# Altium schematic sheet P10_HDMI Framer.SchDoc
size 386 x 246 mm
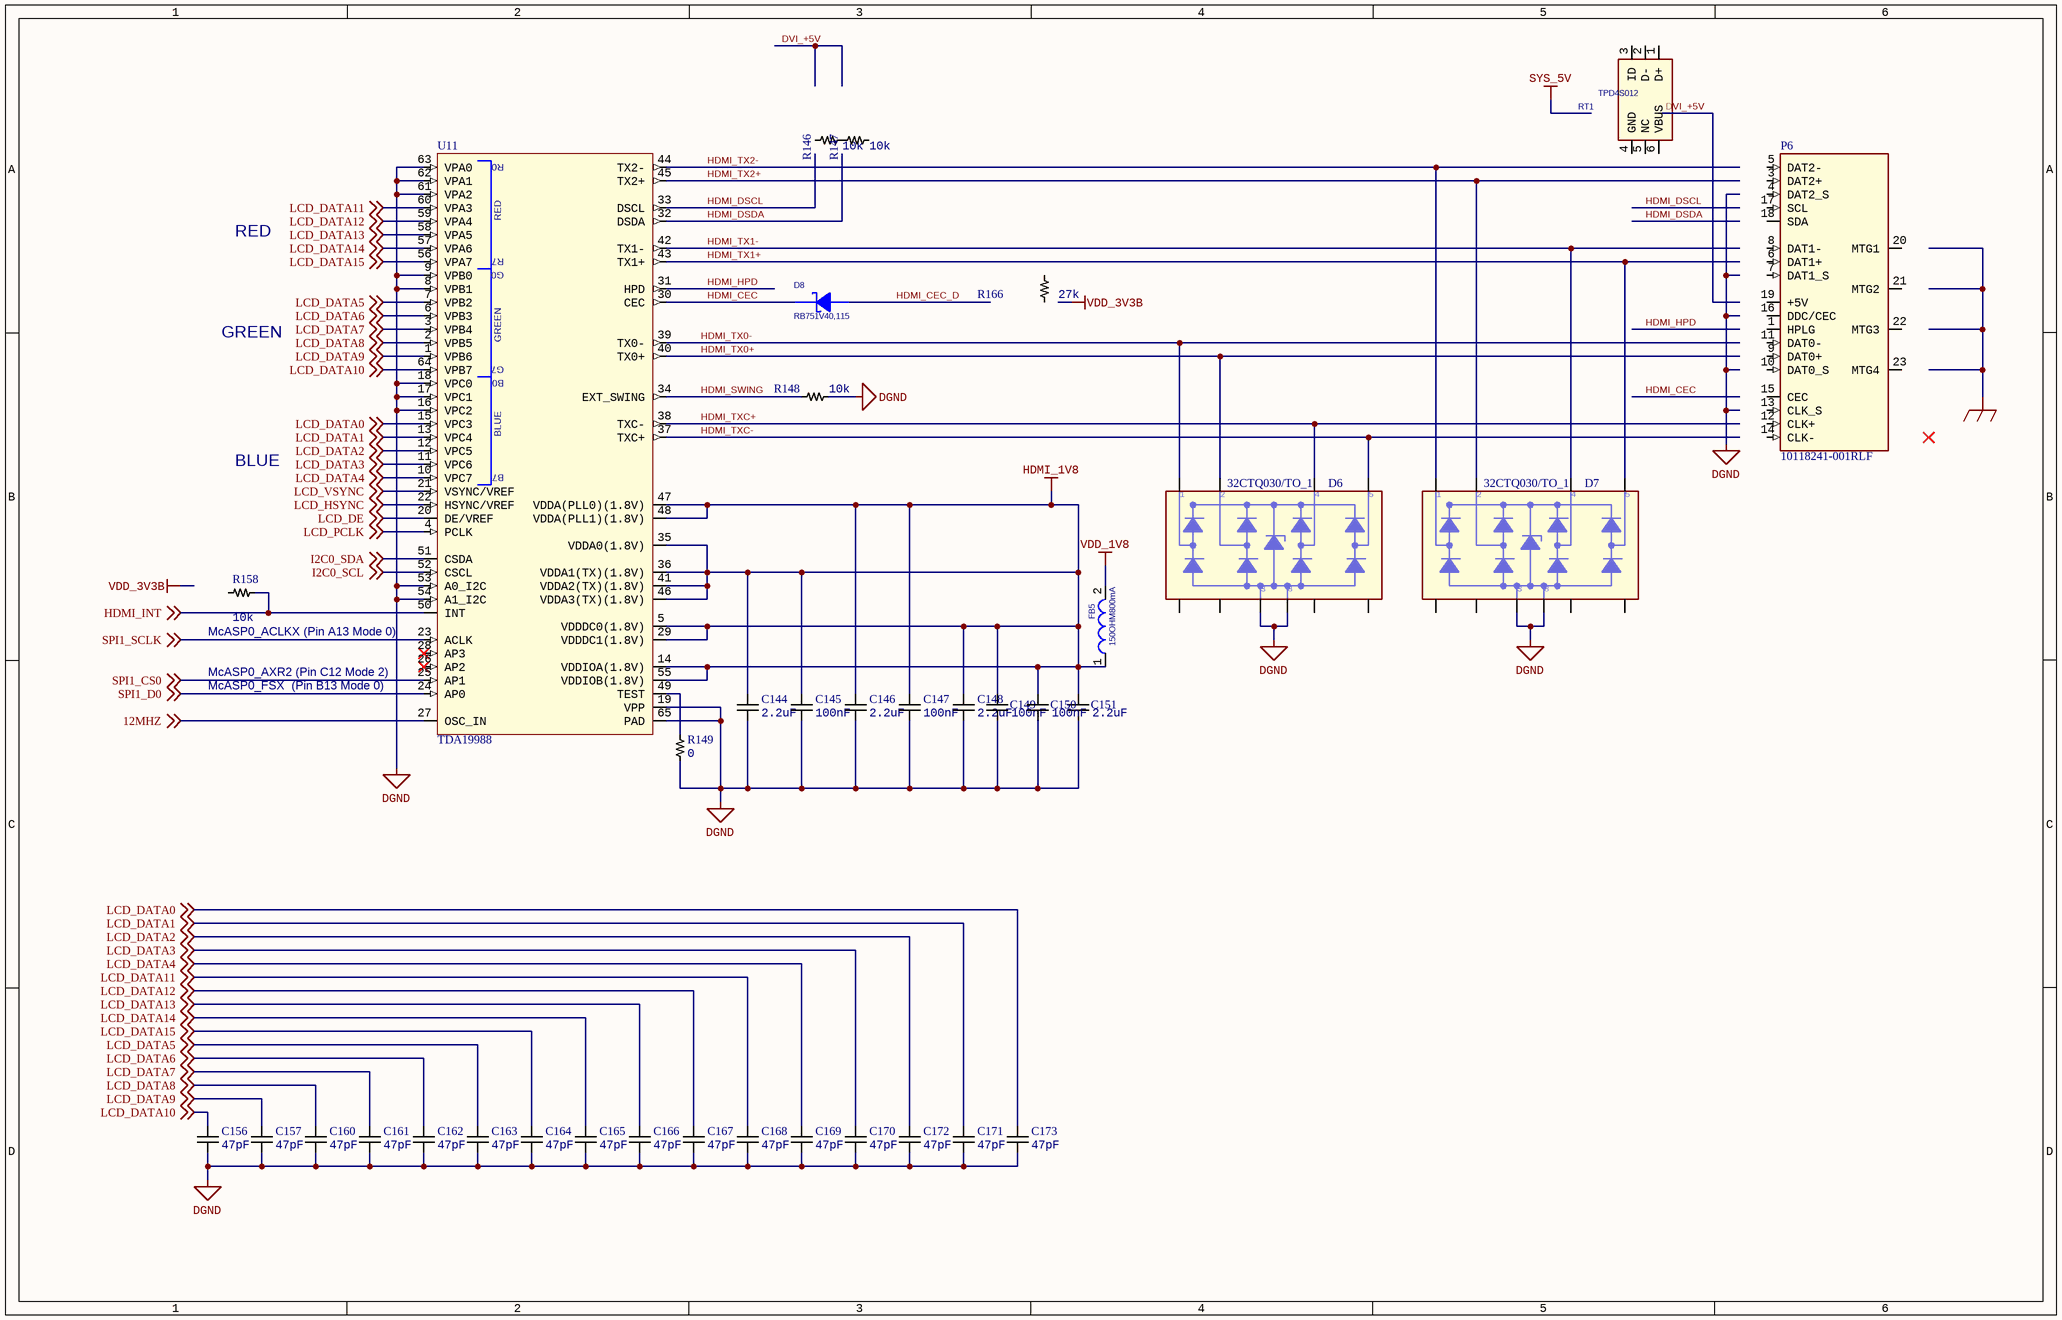
[diagram p0: P10_HDMI Framer.SchDoc]

## Parts
C144  Capacitance: 2.2uF  [CAP0402]  (hidden comment: C1005X5R0J225K050BC)
C145  Capacitance: 100nF  [CAP0402]  (hidden comment: C0402C104K4RACTU)
C146  Capacitance: 2.2uF  [CAP0402]  (hidden comment: C1005X5R0J225K050BC)
C147  Capacitance: 100nF  [CAP0402]  (hidden comment: C0402C104K4RACTU)
C148  Capacitance: 2.2uF  [CAP0402]  (hidden comment: C1005X5R0J225K050BC)
C149  Capacitance: 100nF  [CAP0402]  (hidden comment: C0402C104K4RACTU)
C150  Capacitance: 100nF  [CAP0402]  (hidden comment: C0402C104K4RACTU)
C151  Capacitance: 2.2uF  [CAP0402]  (hidden comment: C1005X5R0J225K050BC)
C156  Capacitance: 47pF  [CAP0402]  (hidden comment: CC0402JRNPO9BN470)
C157  Capacitance: 47pF  [CAP0402]  (hidden comment: CC0402JRNPO9BN470)
C160  Capacitance: 47pF  [CAP0402]  (hidden comment: CC0402JRNPO9BN470)
C161  Capacitance: 47pF  [CAP0402]  (hidden comment: CC0402JRNPO9BN470)
C162  Capacitance: 47pF  [CAP0402]  (hidden comment: CC0402JRNPO9BN470)
C163  Capacitance: 47pF  [CAP0402]  (hidden comment: CC0402JRNPO9BN470)
C164  Capacitance: 47pF  [CAP0402]  (hidden comment: CC0402JRNPO9BN470)
C165  Capacitance: 47pF  [CAP0402]  (hidden comment: CC0402JRNPO9BN470)
C166  Capacitance: 47pF  [CAP0402]  (hidden comment: CC0402JRNPO9BN470)
C167  Capacitance: 47pF  [CAP0402]  (hidden comment: CC0402JRNPO9BN470)
C168  Capacitance: 47pF  [CAP0402]  (hidden comment: CC0402JRNPO9BN470)
C169  Capacitance: 47pF  [CAP0402]  (hidden comment: CC0402JRNPO9BN470)
C170  Capacitance: 47pF  [CAP0402]  (hidden comment: CC0402JRNPO9BN470)
C171  Capacitance: 47pF  [CAP0402]  (hidden comment: CC0402JRNPO9BN470)
C172  Capacitance: 47pF  [CAP0402]  (hidden comment: CC0402JRNPO9BN470)
C173  Capacitance: 47pF  [CAP0402]  (hidden comment: CC0402JRNPO9BN470)
D6  32CTQ030/TO_1  [TSSOP10]
D7  32CTQ030/TO_1  [TSSOP10]
D8  RB751V40,115  [SOD323]
FB5  150OHM800mA  [FB0805]
P6  10118241-001RLF  [CONN19_HDMI]
R146  Resistance: 10k  [RES0402]  (hidden comment: RC0402FR-0710KL)
R147  Resistance: 10k  [RES0402]  (hidden comment: RC0402FR-0710KL)
R148  Resistance: 10k  [RES0402]  (hidden comment: RC0402FR-0710KL)
R149  Resistance: 0  [RES0402]  (hidden comment: RC0402JR-070RL)
R158  Resistance: 10k  [RES0402]  (hidden comment: RC0402FR-0710KL)
R166  Resistance: 27k  [RES0402]  (hidden comment: RC0402FR-0727KL)
RT1  TPD4S012  [U_6_DRY]
U11  TDA19988  [HVQFN-64]

## Nets
DGND: C144.2 C145.2 C146.2 C147.2 C148.2 C149.2 C150.2 C151.2 C156.2 C157.2 C160.2 C161.2 C162.2 C163.2 C164.2 C165.2 C166.2 C167.2 C168.2 C169.2 C170.2 C171.2 C172.2 C173.2 D6.3 D6.8 D7.3 D7.8 R148.2 R149.2 U11.8(VPB1) U11.9(VPB0) U11.16(VPC2) U11.17(VPC1) U11.18(VPC0) U11.19(VPP) U11.53(A0_I2C) U11.54(A1_I2C) U11.61(VPA2) U11.62(VPA1) U11.63(VPA0) U11.65(PAD)
HDMI_1V8: C144.1 C145.1 C146.1 C147.1 C148.1 C149.1 C150.1 C151.1 FB5.1 U11.5(VDDDC0(1.8V)) U11.14(VDDIOA(1.8V)) U11.29(VDDDC1(1.8V)) U11.35(VDDA0(1.8V)) U11.36(VDDA1(TX)(1.8V)) U11.41(VDDA2(TX)(1.8V)) U11.46(VDDA3(TX)(1.8V)) U11.47(VDDA(PLL0)(1.8V)) U11.48(VDDA(PLL1)(1.8V)) U11.55(VDDIOB(1.8V))
VDD_1V8: FB5.2
12MHZ: U11.27(OSC_IN) ; off-sheet 12MHZ
HDMI_CEC: D8.1(C) U11.30(CEC)
HDMI_CEC_D: D8.2(A)
HDMI_DSCL: U11.33(DSCL)
HDMI_DSDA: U11.32(DSDA)
HDMI_HPD: U11.31(HPD)
HDMI_INT: R158.2 U11.50(INT) ; off-sheet HDMI_INT
HDMI_SWING: R148.1 U11.34(EXT_SWING)
HDMI_TX0+: D6.2 U11.40(TX0+)
HDMI_TX0-: D6.1 U11.39(TX0-)
HDMI_TX1+: D7.5 U11.43(TX1+)
HDMI_TX1-: D7.4 U11.42(TX1-)
HDMI_TX2+: D7.2 U11.45(TX2+)
HDMI_TX2-: D7.1 U11.44(TX2-)
HDMI_TXC+: D6.4 U11.38(TXC-)
HDMI_TXC-: D6.5 U11.37(TXC+)
I2C0_SCL: U11.52(CSCL) ; off-sheet I2C0_SCL
I2C0_SDA: U11.51(CSDA) ; off-sheet I2C0_SDA
LCD_DATA0: C173.1 U11.15(VPC3) ; off-sheet LCD_DATA0
LCD_DATA1: C171.1 U11.13(VPC4) ; off-sheet LCD_DATA1
LCD_DATA2: C172.1 U11.12(VPC5) ; off-sheet LCD_DATA2
LCD_DATA3: C170.1 U11.11(VPC6) ; off-sheet LCD_DATA3
LCD_DATA4: C169.1 U11.10(VPC7) ; off-sheet LCD_DATA4
LCD_DATA5: C163.1 U11.7(VPB2) ; off-sheet LCD_DATA5
LCD_DATA6: C162.1 U11.6(VPB3) ; off-sheet LCD_DATA6
LCD_DATA7: C161.1 U11.3(VPB4) ; off-sheet LCD_DATA7
LCD_DATA8: C160.1 U11.2(VPB5) ; off-sheet LCD_DATA8
LCD_DATA9: C157.1 U11.1(VPB6) ; off-sheet LCD_DATA9
LCD_DATA10: C156.1 U11.64(VPB7) ; off-sheet LCD_DATA10
LCD_DATA11: C168.1 U11.60(VPA3) ; off-sheet LCD_DATA11
LCD_DATA12: C167.1 U11.59(VPA4) ; off-sheet LCD_DATA12
LCD_DATA13: C166.1 U11.58(VPA5) ; off-sheet LCD_DATA13
LCD_DATA14: C165.1 U11.57(VPA6) ; off-sheet LCD_DATA14
LCD_DATA15: C164.1 U11.56(VPA7) ; off-sheet LCD_DATA15
LCD_DE: U11.20(DE/VREF) ; off-sheet LCD_DE
LCD_HSYNC: U11.22(HSYNC/VREF) ; off-sheet LCD_HSYNC
LCD_PCLK: U11.4(PCLK) ; off-sheet LCD_PCLK
LCD_VSYNC: U11.21(VSYNC/VREF) ; off-sheet LCD_VSYNC
SPI1_CS0: U11.25(AP1) ; off-sheet SPI1_CS0
SPI1_D0: U11.24(AP0) ; off-sheet SPI1_D0
SPI1_SCLK: U11.23(ACLK) ; off-sheet SPI1_SCLK
NetR146_1: R146.1 R147.2
NetR149_1: R149.1 U11.49(TEST)

Not connected (* = marked no-connect by the designer): D6 6 7 9 10; D7 6 7 9 10; P6 1(HPLG) 3(DAT2+) 4(DAT2_S) 5(DAT2-) 6(DAT1+) 7(DAT1_S) 8(DAT1-) 9(DAT0+) 10(DAT0_S) 11(DAT0-) 12(CLK+) 13(CLK_S) 14(CLK-) 15(CEC) 16(DDC/CEC) 17(SCL) 18(SDA) 19(+5V) 20(MTG1) 21(MTG2) 22(MTG3) 23(MTG4); R146 2; R147 1; R158 1; R166 1 2; RT1 1(D+) 2(D-) 3(ID) 4(GND) 5(NC) 6(VBUS); U11 26(AP2)* 28(AP3)*

## Notes on the sheet
- RED
- GREEN
- BLUE
- McASP0_ACLKX (Pin A13 Mode 0)
- McASP0_AXR2 (Pin C12 Mode 2)
- McASP0_FSX  (Pin B13 Mode 0)
- (in symbol TDA19988) R0; RED; R7; G0; GREEN; G7; B0; BLUE; B7

## Library data of the parts
C144 C146 C148 C151 = CAP_2.2uF: MLCC 2.2uF 0402 SMD; Manufacturer: TDK; Dielectric Material: Ceramic; Tolerance: 10%; Dielectric: X5R; Voltage Rating: 6.3V; Supplier 1: Digi-Key; Manufacturer Part Number: C1005X5R0J225K050BC; Stock 1: 256055; Pricing 1: 1=0.20000, 10=0.13800, 100=0.07010, 500=0.04794, 1000=0.04240, 2500=0.04056, 5000=0.03687 (USD); RoHS: Yes; Mount: Surface Mount; Case/Package: 0402; Number of Pins: 2; Weight: 2.3E-05oz; Case Code (Metric): 1005; Case Code (Imperial): 0402; Min Operating Temperature: -55°C; Max Operating Temperature: 85°C; Packaging: Tape and Reel; Voltage Rating (DC): 6.3V; Termination: SMD/SMT; Package Quantity: 1; Composition: Ceramic; Voltage: 6.3V; Length: 1mm; Height: 0.5mm; Width: 0.02inch; Depth: 0.5mm; Thickness: 0.022inch; Radiation Hardening: No; Lead Free: Lead Free; REACH SVHC: No SVHC; ComponentLink7Description: Datasheet; ComponentLink7URL: https://product.tdk.com/info/en/catalog/datasheets/mlcc_commercial_general_en.pdf?ref_disty=digikey
C145 C147 C149 C150 = CAP_100nF: MLCC 100nF 0402 SMD; Manufacturer: KEMET; Tolerance: 10%; Voltage Rating (DC): 16V; Dielectric: X7R; Dissipation Factor: 3.5%; Supplier 1: Digi-Key; Manufacturer Part Number: C0402C104K4RACTU; Stock 1: 6512243; Pricing 1: 1=0.10000, 10=0.04200, 100=0.01860, 500=0.01328, 1000=0.01044, 2500=0.00949, 5000=0.00873 (USD); RoHS: Yes; Mount: Surface Mount; Case/Package: 0402; Case Code (Imperial): 0402; Case Code (Metric): 1005; Contact Plating: Tin,Matte; Min Operating Temperature: -55°C; Max Operating Temperature: 125°C; Packaging: Tape and Reel; Package Quantity: 10000; Voltage Rating: 16V; Termination: SMD/SMT; Length: 1mm; Height: 0.5mm; Width: 0.5mm; Depth: 0.5mm; Radiation Hardening: No; ComponentLink2URL: https://datasheet.ciiva.com/18192/getdatasheetpartid-385384-18192412.pdf?src-supplier=Verical; ComponentLink2Description: Datasheet; Supplier Part Number 1: 399-3521-1-ND
C156 C157 C160-C173 = CAP_47pF: MLCC 47pF 0402 SMD; Manufacturer: Yageo; Dielectric Material: Ceramic; Tolerance: 5%; Dielectric: C0G; Voltage: 50V; Insulation Resistance: 100GR; Supplier 1: Digi-Key; Manufacturer Part Number: CC0402JRNPO9BN470; Stock 1: 2538955; Pricing 1: 1=0.10000, 10=0.02100, 100=0.00940, 500=0.00668, 1000=0.00525, 2500=0.00478, 5000=0.00439 (USD); RoHS: Yes; Mount: Surface Mount; Case/Package: 0402; Number of Pins: 2; Weight: 2.3E-05oz; Case Code (Metric): 1005; Case Code (Imperial): 0402; Min Operating Temperature: -55°C; Max Operating Temperature: 125°C; Voltage Rating: 50V; Package Quantity: 1; Packaging: Tape and Reel; Voltage Rating (DC): 50V; Termination: SMD/SMT; Composition: Ceramic; Length: 1mm; Height: 0.5mm; Depth: 0.5mm; Width: 0.02inch; Thickness: 0.022inch; Radiation Hardening: No; REACH SVHC: No SVHC; Lead Free: Lead Free; ComponentLink1URL: https://datasheet.ciiva.com/161/mlccorderingcode-161492.pdf?src-supplier=Digi-Key; ComponentLink1Description: https://datasheet.ciiva.com/161/mlccorderingcode-161492.pdf?src-supplier=Digi-Key; ComponentLink2URL: https://datasheet.ciiva.com/161/mlccorderingcode-161493.pdf?src-supplier=Digi-Key; ComponentLink2Description: https://datasheet.ciiva.com/161/mlccorderingcode-161493.pdf?src-supplier=Digi-Key; ComponentLink3URL: https://datasheet.ciiva.com/8033/1443161-8033637.pdf?src-supplier=Element14; ComponentLink3Description: https://datasheet.ciiva.com/8033/1443161-8033637.pdf?src-supplier=Element14; ComponentLink4URL: https://datasheet.ciiva.com/161/mlccorderingcode-161494.pdf?src-supplier=Digi-Key; ComponentLink4Description: https://datasheet.ciiva.com/161/mlccorderingcode-161494.pdf?src-supplier=Digi-Key; ComponentLink5URL: https://datasheet.ciiva.com/8033/1443161-8033638.pdf?src-supplier=Element14; ComponentLink5Description: https://datasheet.ciiva.com/8033/1443161-8033638.pdf?src-supplier=Element14; ComponentLink6URL: https://datasheet.ciiva.com/17437/upy-gp-np0-16v-to-50v-8-17437546.pdf?src-supplier=Avnet+Europe; ComponentLink6Description: https://datasheet.ciiva.com/17437/upy-gp-np0-16v-to-50v-8-17437546.pdf?src-supplier=Avnet+Europe; ComponentLink7URL: https://datasheet.ciiva.com/28450/1443161-28450267.pdf?src-supplier=Element14; ComponentLink7Description: https://datasheet.ciiva.com/28450/1443161-28450267.pdf?src-supplier=Element14
D8 = Zener: DIODE SCHOTTKY 40V 120MA SOD323; Manufacturer: NXP Semiconductors; Current - Average Rectified (Io): 120mA (DC); Voltage - Forward (Vf) (Max) @ If: 370mV @ 1mA; Speed: Small Signal =< 200mA (Io), Any Speed; Current - Reverse Leakage @ Vr: 500nA @ 30V; Capacitance @ Vr, F: 2pF @ 1V, 1MHz; Supplier 1: Digi-Key; Supplier Part Number 1: 568-8119-6-ND; Manufacturer Part Number: RB751V40,115; RoHS: RoHS Compliant; Category: Discrete Semiconductor Products; Stock 1: 5326; Pricing 1: 1=0.29, 10=0.26, 25=0.1872, 100=0.1456, 250=0.09152, 500=0.07798, 1000=0.05313 (USD); Diode Type: Schottky; Voltage - DC Reverse (Vr) (Max): 40V; Reverse Recovery Time (trr): -; Mounting Type: Surface Mount; Package / Case: SC-76, SOD-323; Supplier Device Package: SOD-323; Packaging: Digi-Reel®; ComponentLink1URL: http://www.nxp.com/documents/data_sheet/RB751_SER.pdf; ComponentLink1Description: http://www.nxp.com/documents/data_sheet/RB751_SER.pdf
FB5 = IND: FERRITE 800MA 150 OHM 0805 SMD; Manufacturer: Laird-Signal Integrity Products; Manufacturer Part Number: LI0805H151R-10; Impedance @ Frequency: 150 Ohm @ 100MHz; DC Resistance (DCR): 150 mOhm Max; Filter Type: Differential Mode - Single; Supplier 1: Digi-Key; Supplier Part Number 1: 240-2384-6-ND; RoHS: RoHS Compliant; Category: Filters; Stock 1: 10144; Pricing 1: 1=0.1, 10=0.07, 25=0.064, 50=0.0574, 100=0.0421, 250=0.03064, 500=0.02808, 1000=0.02424 (USD); Current Rating: 800mA; Package / Case: 0805 (2012 Metric); Mounting Type: Surface Mount; Packaging: Digi-Reel®; Height (Max): 0.043" (1.10mm); Size / Dimension: 0.079" L x 0.049" W (2.00mm x 1.25mm); ComponentLink1URL: http://www.lairdtech.com/WorkArea/linkit.aspx?LinkIdentifier=id&ItemID=4912; ComponentLink1Description: http://www.lairdtech.com/WorkArea/linkit.aspx?LinkIdentifier=id&ItemID=4912
P6 = Micro HDMI: CONN HDMI RECPT 19POS SMT R/A; Manufacturer: FCI; Number of Contacts: 19; Gender: Receptacle; Supplier 1: Digi-Key; Supplier Part Number 1: 609-4615-6-ND; Manufacturer Part Number: 10118241-001RLF; RoHS: RoHS Compliant; Category: Connectors, Interconnects; Stock 1: 6779; Pricing 1: 1=1.34, 10=1.174, 25=1.1052, 50=1.059, 100=1.013, 250=0.92092 (USD); Connector Type: HDMI; Specifications: -; Mounting Type: Surface Mount, Right Angle, Horizontal; Features: Shielded, Solder Retention; Packaging: Digi-Reel®; Ingress Protection: -; ComponentLink1URL: http://portal.fciconnect.com/Comergent//fci/drawing/10118241.pdf; ComponentLink1Description: http://portal.fciconnect.com/Comergent//fci/drawing/10118241.pdf
R146-R148 R158 = RES_10k: Resistor 10kOhm 0402 SMD; Manufacturer: Yageo; Temperature Coefficient: 100ppm/°C; Tolerance: 1%; Voltage Rating (DC): 50V; Power Rating: 62.5mW; Supplier 1: Digi-Key; Manufacturer Part Number: RC0402FR-0710KL; RoHS: Yes; Stock 1: 72891652; Pricing 1: 1=0.10000, 10=0.01500, 100=0.00600, 1000=0.00270, 2500=0.00235, 5000=0.00194 (USD); Composition: Thick Film; Height: 0.32mm; Number of Terminations: 2; Packaging: Tape and Reel; ComponentLink1URL: https://datasheet.ciiva.com/7660/38568-7660787.pdf?src-supplier=Element14; ComponentLink1Description: https://datasheet.ciiva.com/7660/38568-7660787.pdf?src-supplier=Element14; Case/Package: 0402; Number of Pins: 2; Case Code (Imperial): 0402; Case Code (Metric): 1005; Min Operating Temperature: -55°C; Max Operating Temperature: 155°C; Voltage Rating: 50V; Termination: SMD/SMT; Military Standard: Not; Working Voltage: 50V; Length: 1mm; Width: 0.5mm; Depth: 0.5mm; Lead Pitch: 0.2mm; REACH SVHC: No SVHC; Lead Free: Lead Free; ComponentLink2URL: https://datasheet.ciiva.com/7983/1018594-7983486.pdf?src-supplier=Element14; ComponentLink2Description: https://datasheet.ciiva.com/7983/1018594-7983486.pdf?src-supplier=Element14; ComponentLink3URL: https://datasheet.ciiva.com/7849/1784430-7849813.pdf?src-supplier=Element14; ComponentLink3Description: https://datasheet.ciiva.com/7849/1784430-7849813.pdf?src-supplier=Element14; ComponentLink4URL: https://datasheet.ciiva.com/7849/1686128-7849814.pdf?src-supplier=Element14; ComponentLink4Description: https://datasheet.ciiva.com/7849/1686128-7849814.pdf?src-supplier=Element14; ComponentLink5URL: https://datasheet.ciiva.com/7849/1784430-7849815.pdf?src-supplier=Element14; ComponentLink5Description: https://datasheet.ciiva.com/7849/1784430-7849815.pdf?src-supplier=Element14; ComponentLink6URL: https://datasheet.ciiva.com/22747/1018594-22747512.pdf?src-supplier=Element14; ComponentLink6Description: https://datasheet.ciiva.com/22747/1018594-22747512.pdf?src-supplier=Element14; ComponentLink7URL: https://datasheet.ciiva.com/12667/pyu-rc0402-51-rohs-l-6-r-12667067.pdf?src-supplier=Mouser; ComponentLink7Description: https://datasheet.ciiva.com/12667/pyu-rc0402-51-rohs-l-6-r-12667067.pdf?src-supplier=Mouser
R149 = RES_0: Resistor 0Ohm 0402 SMD; Manufacturer: Yageo; Temperature Coefficient: 200ppm/°C; Tolerance: 5%; Power Rating: 62.5mW; Voltage Rating: 50V; Max Power Dissipation: 63mW; Supplier 1: Digi-Key; Supplier Part Number 1: 311-0.0JRCT-ND; Manufacturer Part Number: RC0402JR-070RL; RoHS: Yes; Stock 1: 68160806; Pricing 1: 1=0.10000, 10=0.01300, 25=0.00920, 50=0.00700, 100=0.00510, 250=0.00392, 500=0.00312, 1000=0.00230, 5000=0.00165 (USD); Composition: Thick Film; Features: Moisture Resistant; Height: 0.016inch; Number of Terminations: 2; Packaging: Tape and Reel; ComponentLink1URL: https://www.digikey.com/product-detail/en/yageo/RC0402JR-070RL/311-0.0JRCT-ND/729353; ComponentLink1Description: Digikey; Case/Package: 0402; Contact Plating: Tin,Matte; Case Code (Metric): 1005; Case Code (Imperial): 0402; Min Operating Temperature: -55°C; Max Operating Temperature: 155°C; Termination: SMD/SMT; Package Quantity: 1; Military Standard: Not; Length: 1mm; Width: 0.02inch; Depth: 0.5mm; Radiation Hardening: No; Lead Free: Lead Free; REACH SVHC: Unknown; ComponentLink2Description: Datasheet; ComponentLink2URL: https://www.yageo.com/upload/media/product/productsearch/datasheet/rchip/PYu-RC_Group_51_RoHS_L_10.pdf
R166 = RES_27k: Resistor 27kOhm 0402 SMD; Manufacturer: Yageo; Temperature Coefficient: 100ppm/°C; Tolerance: 1%; Power Rating: 63mW; Voltage Rating: 50V; Supplier 1: Digi-Key; Manufacturer Part Number: RC0402FR-0727KL; RoHS: Yes; Stock 1: 2429807; Pricing 1: 1=0.10000, 10=0.01600, 100=0.00640, 1000=0.00289, 2500=0.00251, 5000=0.00207 (USD); Composition: Thick Film; Features: Moisture Resistant; Height: 0.016inch; Number of Terminations: 2; Packaging: Tape and Reel; ComponentLink1URL: https://datasheet.ciiva.com/11819/0900766b80c66297-11819497.pdf?src-supplier=RSComponents; ComponentLink1Description: https://datasheet.ciiva.com/11819/0900766b80c66297-11819497.pdf?src-supplier=RSComponents; Case/Package: 0402; Case Code (Imperial): 0402; Case Code (Metric): 1005; Min Operating Temperature: -55°C; Max Operating Temperature: 155°C; Package Quantity: 10000; Termination: SMD/SMT; Military Standard: Not; Max Power Dissipation: 63mW; Length: 1mm; Width: 0.02inch; Depth: 0.5mm; REACH SVHC: Unknown; Lead Free: Lead Free; ComponentLink2URL: https://datasheet.ciiva.com/7849/1018594-7849925.pdf?src-supplier=Element14; ComponentLink2Description: https://datasheet.ciiva.com/7849/1018594-7849925.pdf?src-supplier=Element14; ComponentLink3URL: https://datasheet.ciiva.com/2453/pyu-r-int-thick-7-2453562.pdf?src-supplier=Digi-Key; ComponentLink3Description: https://datasheet.ciiva.com/2453/pyu-r-int-thick-7-2453562.pdf?src-supplier=Digi-Key; ComponentLink4URL: https://datasheet.ciiva.com/16772/pyu-rc0402-51-rohs-l-6-r-16772092.pdf?src-supplier=Future+Electronics; ComponentLink4Description: https://datasheet.ciiva.com/16772/pyu-rc0402-51-rohs-l-6-r-16772092.pdf?src-supplier=Future+Electronics
RT1 = PROT_TPD4S012: ESD 4channel USB Interface; Manufacturer: Texas Instruments; Manufacturer Part Number: TPD4S012DRYR; Mfr: TI; MfrNum: TPD4S012DRY; TIIntPartnumber: 1A0233; Vendor: Digikey; Cost100: 0.76; Cost10K: 0.23; Power (Watts): 60W; Number of Circuits: 4; Supplier 1: Digi-Key; Supplier Part Number 1: 296-24244-6-ND; RoHS: RoHS Compliant; Category: Circuit Protection; Stock 1: 7978; Pricing 1: 1=0.78, 10=0.682, 25=0.6028, 100=0.2552, 250=0.25044, 500=0.2457, 750=0.24097 (USD); Package / Case: 6-UFDFN; Packaging: Digi-Reel®; ComponentLink1URL: http://www.ti.com/lit/ds/symlink/tpd4s012.pdf; ComponentLink1Description: http://www.ti.com/lit/ds/symlink/tpd4s012.pdf; PartName: TPD4S012; Voltage - Working: -; Voltage - Clamping: -; Technology: Mixed Technology; Applications: USB; Supplier Device Package: 6-SON (1.45x1)
U11 = TDA19988: IC HDMI TRANSMITTER 64-HVQFN; Manufacturer: NXP Semiconductors; Manufacturer Part Number: TDA19988AHN/C1,551; Supplier 1: Digi-Key; Supplier Part Number 1: TDA19988AHN/C1,551-ND; RoHS: RoHS Compliant; Category: Integrated Circuits (ICs); Stock 1: 0; Pricing 1: 260=4.59 (USD); Type: HDMI Transmitter; Applications: Set-Top Boxes; Mounting Type: Surface Mount; Package / Case: 64-VFQFN Exposed Pad; Supplier Device Package: 64-HVQFN (9x9); Packaging: Tray; ComponentLink1Description: Digikey; ComponentLink1URL: https://www.digikey.com/product-detail/en/nxp-usa-inc/TDA19988BHN-C1557/568-12059-ND/2780352; ComponentLink2Description: Datasheet; ComponentLink2URL: https://media.digikey.com/pdf/Data%20Sheets/NXP%20PDFs/TDA19988_DS_21_july_2011.pdf